# Altium schematic sheet Inverter.SchDoc
size A; SPICEModelCacheCTQXAXMB: <root> / <DocumentId>CTQXAXMB</DocumentId> / <CacheFrame Number="0"> / <Model Name="cap" Kind="MDL"> / <Text>*Default semiconductor capacitor / .MODEL CAP C()</Text> / </Model> / <Model Name="zener" Kind="MDL"> / <Text>*ZENER / *Default Zener 10V @ 10mA / *Zener Diode Pinout: A,K / .MODEL ZENER D( BV=10 IBV=10E-3 )</Text> / </Model> / </CacheFrame> / </root>
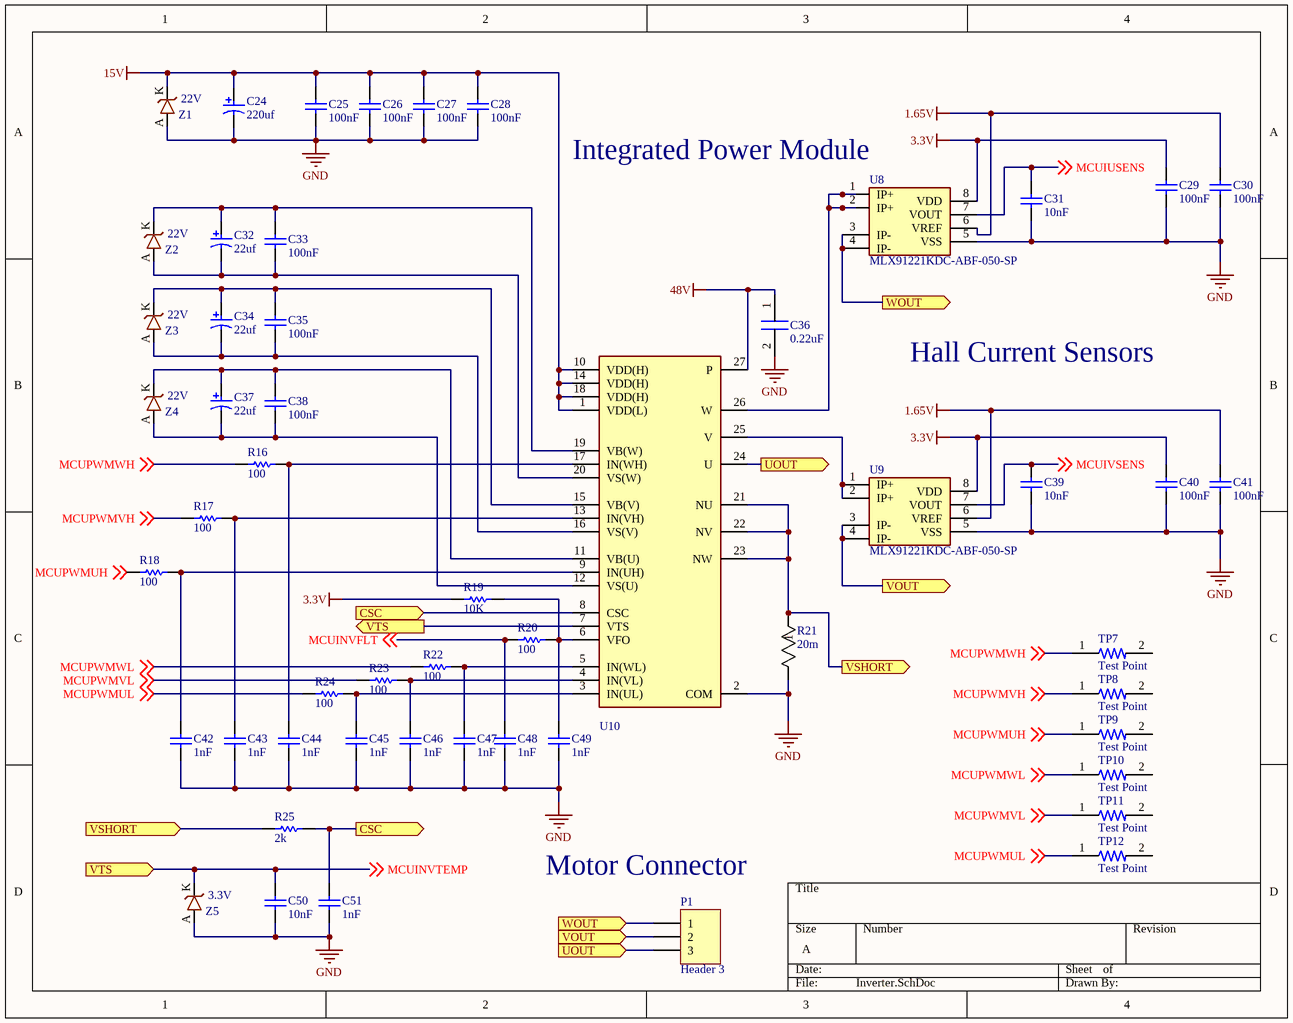
[diagram p0: Inverter.SchDoc]

## Parts
C24  220uf  [PNSC-ECA-1VM221-2]
C25  100nF  [CAPC1609X100X15LL20]
C26  100nF  [CAPC1609X100X15LL20]
C27  100nF  [CAPC1609X100X15LL20]
C28  100nF  [CAPC1609X100X15LL20]
C29  100nF  [CAPC1609X100X15LL20]
C30  100nF  [CAPC1609X100X15LL20]
C31  10nF  [CAPC1609X100X15LL20]
C32  22uf  [CAPPR55-200-1100X500X1200]
C33  100nF  [CAPC1609X100X15LL20]
C34  22uf  [CAPPR55-200-1100X500X1200]
C35  100nF  [CAPC1609X100X15LL20]
C36  0.22uF  [B32652A3224K000]
C37  22uf  [CAPPR55-200-1100X500X1200]
C38  100nF  [CAPC1609X100X15LL20]
C39  10nF  [CAPC1609X100X15LL20]
C40  100nF  [CAPC1609X100X15LL20]
C41  100nF  [CAPC1609X100X15LL20]
C42  1nF  [CAPC1609X100X15LL20]
C43  1nF  [CAPC1609X100X15LL20]
C44  1nF  [CAPC1609X100X15LL20]
C45  1nF  [CAPC1609X100X15LL20]
C46  1nF  [CAPC1609X100X15LL20]
C47  1nF  [CAPC1609X100X15LL20]
C48  1nF  [CAPC1609X100X15LL20]
C49  1nF  [CAPC1609X100X15LL20]
C50  10nF  [CAPC1609X100X15LL20]
C51  1nF  [CAPC1609X100X15LL20]
P1  Header 3  [3-Pin TB 5mm Pitch]
R16  100  [RESC1609X50X30NL8T20]
R17  100  [RESC1609X50X30NL8T20]
R18  100  [RESC1609X50X30NL8T20]
R19  10K  [RESC1609X50X30NL8T20]
R20  100  [RESC1609X50X30NL8T20]
R21  20m  [RES_BR3_STP]
R22  100  [RESC1609X50X30NL8T20]
R23  100  [RESC1609X50X30NL8T20]
R24  100  [RESC1609X50X30NL8T20]
R25  2k  [RESC1609X50X30NL8T20]
TP7  Test Point  [RESC3216X70N]
TP8  Test Point  [RESC3216X70N]
TP9  Test Point  [RESC3216X70N]
TP10  Test Point  [RESC3216X70N]
TP11  Test Point  [RESC3216X70N]
TP12  Test Point  [RESC3216X70N]
U8  MLX91221KDC-ABF-050-SP  [SOIC8]
U9  MLX91221KDC-ABF-050-SP  [SOIC8]
U10  FNB34060T  [FNB34060T]  (value not drawn)
Z1  22V  [DO-214AA]
Z2  22V  [DO-214AA]
Z3  22V  [DO-214AA]
Z4  22V  [DO-214AA]
Z5  3.3V  [SOD123]

## Ports
CSC (in), CSC (out), UOUT (in), UOUT (out), VOUT (in), VOUT (out), VSHORT (in), VSHORT (out), VTS (in), VTS (out), WOUT (in), WOUT (out)

## Nets
1.65V: C30.2 C41.2 U8.6(VREF) U9.6(VREF)
3.3V: C29.2 C40.2 R19.2 U8.8(VDD) U9.8(VDD)
15V: C24.1 C25.2 C26.2 C27.2 C28.2 U10.1(VDD(L)) U10.10(VDD(H)) U10.14(VDD(H)) U10.18(VDD(H)) Z1.K
48V: C36.1 U10.27(P)
GND: C24.2 C25.1 C26.1 C27.1 C28.1 C29.1 C30.1 C31.1 C36.2 C39.1 C40.1 C41.1 C42.1 C43.1 C44.1 C45.1 C46.1 C47.1 C48.1 C49.1 C50.1 C51.1 R21.2 U8.5(VSS) U9.5(VSS) U10.2(COM) Z1.A Z5.A
CSC: C51.2 R25.1 U10.8(CSC) ; port CSC
MCUINVFLT: C48.2 R20.2 ; off-sheet MCUINVFLT
MCUINVTEMP: C50.2 U10.7(VTS) Z5.K ; off-sheet MCUINVTEMP, port VTS
MCUIUSENS: C31.2 U8.7(VOUT) ; off-sheet MCUIUSENS
MCUIVSENS: C39.2 U9.7(VOUT) ; off-sheet MCUIVSENS
MCUPWMUH: R18.2 TP9.1 ; off-sheet MCUPWMUH
MCUPWMUL: R24.2 TP12.1 ; off-sheet MCUPWMUL
MCUPWMVH: R17.2 TP8.1 ; off-sheet MCUPWMVH
MCUPWMVL: R23.2 TP11.1 ; off-sheet MCUPWMVL
MCUPWMWH: R16.2 TP7.1 ; off-sheet MCUPWMWH
MCUPWMWL: R22.2 TP10.1 ; off-sheet MCUPWMWL
UOUT: P1.3 U10.24(U) ; port UOUT
VOUT: P1.2 U9.3(IP-) U9.4(IP-) ; port VOUT
VSHORT: R21.1 R25.2 U10.21(NU) U10.22(NV) U10.23(NW) ; port VSHORT
WOUT: P1.1 U8.3(IP-) U8.4(IP-) ; port WOUT
NetC32_1: C32.1 C33.2 U10.19(VB(W)) Z2.K
NetC32_2: C32.2 C33.1 U10.20(VS(W)) Z2.A
NetC34_1: C34.1 C35.2 U10.15(VB(V)) Z3.K
NetC34_2: C34.2 C35.1 U10.16(VS(V)) Z3.A
NetC37_1: C37.1 C38.2 U10.11(VB(U)) Z4.K
NetC37_2: C37.2 C38.1 U10.12(VS(U)) Z4.A
NetC42_2: C42.2 R18.1 U10.9(IN(UH))
NetC43_2: C43.2 R17.1 U10.13(IN(VH))
NetC44_2: C44.2 R16.1 U10.17(IN(WH))
NetC45_2: C45.2 R24.1 U10.3(IN(UL))
NetC46_2: C46.2 R23.1 U10.4(IN(VL))
NetC47_2: C47.2 R22.1 U10.5(IN(WL))
NetC49_2: C49.2 R19.1 R20.1 U10.6(VFO)
NetU8_1: U8.1(IP+) U8.2(IP+) U10.26(W)
NetU9_1: U9.1(IP+) U9.2(IP+) U10.25(V)

Not connected (* = marked no-connect by the designer): TP7 2; TP8 2; TP9 2; TP10 2; TP11 2; TP12 2

## Notes on the sheet
- (near U8) Integrated Power Module
- Hall Current Sensors
- (near P1) Motor Connector

## Library data of the parts
C24 = CMP-2000-05311-1: Aluminum Electrolytic Capacitor, 220 uF, +/- 20%, 35 V, -40 to 85 degC, 2-Pin THD, RoHS, Bulk; Manufacturer: Panasonic; Lifetime@Temperature: 2000Hrs@85degC; Rated Voltage: 35V; Ripple Current: 350mA; Type: Radial; Capacitance: 220µF; Package Reference: ECA-1VM221; Series: M; Operating Temp Range: -40to+85degC; Package Description: 2-Pin Axial Lead, Dia 8 mm, Body Length 12.5 mm; Datasheet Version: Mar-06; Datasheet URL: https://datasheet.ciiva.com/26341/441851-da-01-en-elko-eca1vm221-m-r-220myf-35v-85c-26341906.pdf; Operating Temp-Max: 85degC; Case Size/Dimension: Ø8x11.5mm; Manufacturer URL: http://www.panasonic.com/
C25-C31 C33 C35 C38-C51 = CMP-2006-00186-1: Manufacturer: AVX Interconnect / Elco; Part Number: TACL105M006XTA
C32 C34 C37 = CMP-1665-00036-2: Aluminum Electrolytic Capacitor, 22 uF, +/- 20%, 50 V, -40 to 85 degC, 2-Pin THD, RoHS, Bulk; Manufacturer: Panasonic; Ripple Current: 100mA; Life (Hours): 2000Hour; Voltage: 50V; Dissipation Factor: 0.12%; Leakage Current: 3uA; Lead/Base Style: Straight; Lead Diameter: 0.5mm; Max Operating Temperature: 85degC; Height: 11mm; Package Reference: CAPPR55-200-1100X500X1200; Radiation Hardening: No; RoHSCompliant: true; Termination: Radial; Case/Package: Radial; REACH SVHC: NoSVHC; Height - Seated (Max): 0.472inch; Min Operating Temperature: -40degC; Packaging: Bulk; Manufacturer URL: http://www.panasonic.com/; Length: 11mm; Tolerance: 20%; Voltage Rating: 50V; Voltage Rating (DC): 50V; Datasheet URL: https://industrial.panasonic.com/cdbs/www-data/pdf/RDF0000/ABA0000C1218.pdf; Lead Pitch: 2mm; Ripple Current (AC): 100mA; Package Description: 2-Pin Radial Lead, Dia 5 mm, Height 12 mm; Diameter: 5mm; Capacitance: 22uF; Datasheet Version: Rev. 05, 10/2016; Package Quantity: 200; Mount: ThroughHole
C36 = B32652A3224K000: Capacitor, Film, 15mm leads
P1 = Header 3: Header, 3-Pin; LatestRevisionDate: 17-Jul-2002; LatestRevisionNote: Re-released for DXP Platform.; Publisher: Altium Limited
R16-R20 R22-R25 = CMP-2000-03816-5: Chip Resistor, 0 Ohm, Jumper, 100 mW, -55 to 155 degC, 0603 (1608 Metric), RoHS, Tape and Reel; Manufacturer: Vishay Semiconductor; Voltage Rating: 75 V; Package Quantity: 5000; DatasheetVersion: 06/2012; Min Operating Temperature: -55 degC; ComponentLink1URL: http://www.vishay.com/; Mounting Technology: Surface Mount; Height: 0.45 mm; ComponentLink1Description: Manufacturer URL; REACH SVHC: Unknown; PackageReference: 0603; Packaging: Tape and Reel; Max Operating Temperature: 155 degC; Mount: Surface Mount; ComponentLink2Description: Datasheet; PackageDescription: 2-Pin Surface Mount Device, Body 1.575 x 0.85 mm; Length: 1.55 mm; ComponentLink2URL: http://www.vishay.com/docs/20035/dcrcwe3.pdf; Pins: 2; RoHSCompliant: true
R21 = BR3FB5L00: No Description Available; Mfr_Name: Stackpole International; Copyright: Copyright (C) 2022 Ultra Librarian. All rights reserved.; Manufacturer_Part_Number: BR3FB5L00; Digi-Key_Part_Number_1: BR3FB5L00-ND; RefDes: RefDes; Type: DEV
TP7-TP12 = RCWCTE: PC Test Point , Plating Surface Mount Mounting Type; MF: KOA Speer; Package: 1206 KOA Speer; Value: *; Price: None; Availability: Unavailable; MP: RCWCTE; SnapEDA_Link: https://www.snapeda.com/parts/RCWCTE/KOA%20Speer/view-part/1310479/?ref=snap
U8 U9 = MLX91221KDC-ABF-050-SP: Hall Current Sensor
Z1-Z4 = D: Zener Diode, DO-214AA
Z5 = SOD123: Zener Diode, SOD123